# EAGLE design anet-cap-z-probe (EAGLE 6.1)
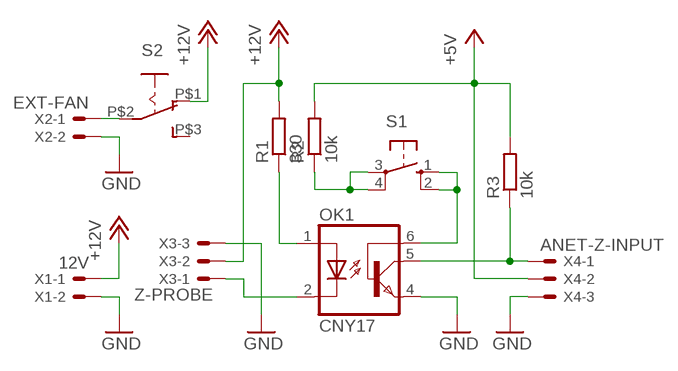
[diagram p0: schematic, sheet 1]

## Parts
OK1  CNY17  [DIL06]
R1  330  R-EU_R0805  [R0805]
R2  10k  R-EU_R0805  [R0805]
R3  10k  R-EU_R0805  [R0805]
S1  10-XX  [B3F-10XX]
S2  EG1218THIN  [THIN]
X1  12V  JST-XH-02-PIN-LONG-PAD  [JST-XH-02-PACKAGE-LONG-PAD]
X2  EXT-FAN  JST-XH-02-PIN-LONG-PAD  [JST-XH-02-PACKAGE-LONG-PAD]
X3  Z-PROBE  JST-XH-03-PIN-LONG-PAD  [JST-XH-03-PACKAGE-LONG-PAD]
X4  ANET-Z-INPUT  JST-XH-03-PIN-LONG-PAD  [JST-XH-03-PACKAGE-LONG-PAD]

## Nets
+5V: R2.2 R3.2 X4.2
+12V: R1.2 S2.P$1(O) X1.1 X3.2
GND: OK1.4(EMI) X1.2 X2.2 X3.3 X4.3
N$1: S2.P$2(P) X2.1
N$2: OK1.5(COL) R3.1 X4.1
N$4: R2.1 S1.3(P) S1.4(P1)
N$5: OK1.6(BAS) S1.1(S) S1.2(S1)
N$6: OK1.1(A) R1.1
N$7: OK1.2(C) X3.1
Unconnected: S2.P$3(S)

## Library data of the parts
OK1 = optocoupler:CNY17: SIEMENS OPTO COUPLER; MPN: CNY17-1; OC_FARNELL: 1045399; OC_NEWARK: 05M4044
R1-R3 = rcl:R-EU_: RESISTOR, European symbol
S1 = switch-omron:10-XX: OMRON SWITCH; MPN: B3F-1000; OC_FARNELL: 176432; OC_NEWARK: 36M3542
S2 = _MY_OWN_LIB:EG1218: SLIDING SWITCH 0.1" spacing through hole, vertical SPDT slide switch http://www.ladyada.net/library/pcb/eaglelibrary.html
X1 X2 = Rembrandt Electronics - JST XH Connectors v1-0:JST-XH-02-PIN: JST XH Connector 2 Pin Wire to board connector. Pitch: 2,54 mm, (0.100") Number of pins: 2 Created by Rembrandt Electronics www.rembrandtelectronics.com
X3 X4 = Rembrandt Electronics - JST XH Connectors v1-0:JST-XH-03-PIN: JST XH Connector 2 Pin Wire to board connector. Pitch: 2,54 mm, (0.100") Number of pins: 3 Created by Rembrandt Electronics www.rembrandtelectronics.com

## Board
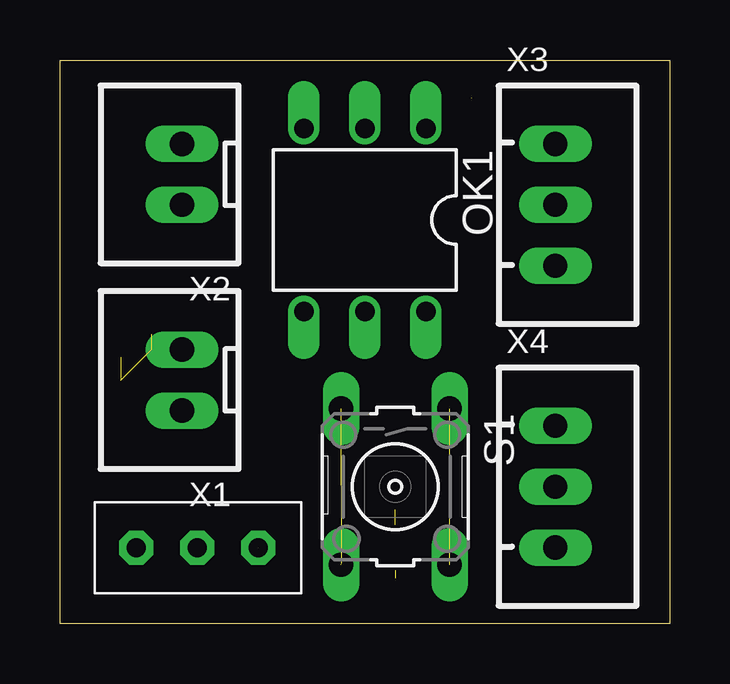
[diagram p1: board, top side]
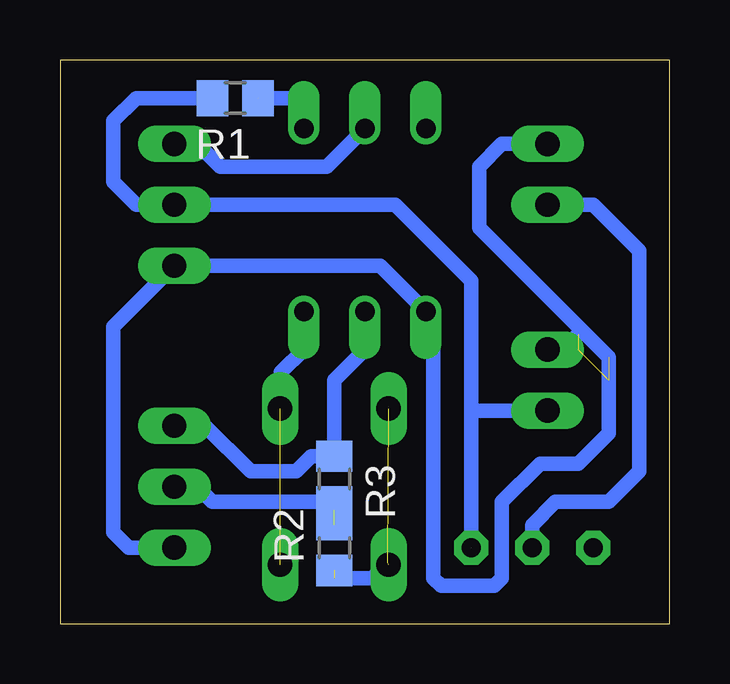
[diagram p2: board, bottom side, seen from below]

Size 25.4 x 23.5 mm. Coordinates in mm from the lower left corner, seen from the top.
Outline: 0,0 0,23.5 25.4,23.5 25.4,0 0,0
Copper layers (1*16): Top 0.035mm / dielectric 1.5mm / Bottom 0.035mm
Design rules: minimum track width 10mil, minimum drill 24mil, track to track 12mil, track to pad 12mil, pad to pad 12mil, via to via 12mil, smd to smd 10mil, copper to edge 12mil, drill to drill 12mil, minimum pad ring 10mil, minimum via ring 10mil, stop-mask expansion 4mil, vias tented up to drill 0mil, thermal gap 12mil

### Footprints (pad centres in the part's own frame; a part is rotated, then mirrored left to right if it is on the bottom)
DIL06 = drill 0.813 offset: 1 -2.54,-3.81; 2 0,-3.81; 3 2.54,-3.81; 4 2.54,3.81; 5 0,3.81; 6 -2.54,3.81
R0805 = smd 1.3 x 1.5: 1 -0.95,0; 2 0.95,0
B3F-10XX = drill 1.016 long: 1 -3.251,2.261; 2 3.251,2.261; 3 -3.251,-2.261; 4 3.251,-2.261
THIN = drill 0.8 pad 1.422 octagon: P$1 -2.548,-0.002; P$2 -0.008,-0.002; P$3 2.532,-0.002
JST-XH-02-PACKAGE-LONG-PAD = drill 1.016 long: 1 -1.27,0; 2 1.27,0
JST-XH-03-PACKAGE-LONG-PAD = drill 1.016 long: 1 -2.54,0; 2 0,0; 3 2.54,0

### Placement (x,y rotation side)
OK1  12.7,16.83 180 top
R1  18.1,21.91 180 bottom
R2  13.97,3.17 90 bottom
R3  13.97,6.03 270 bottom
S1  13.97,5.71 270 top
S2  5.71,3.17 180 top
X1  5.08,10.16 90 top
X2  5.08,18.73 90 top
X3  20.64,17.46 270 top
X4  20.64,5.71 270 top

### Tracks (layer width: path | path; a pad name or v marks a point on that pad's centre or on a via)
+5V  (1 unrouted)
  Bottom 0.61: R3.2 | 13.97,4.76 R3.2 | R3.2 19.05,5.08 19.68,5.71 X4.2
+12V  (1 unrouted)
  Bottom 0.61: R1.2 22.23,21.91 23.18,20.95 23.18,18.41 22.23,17.46 X3.2 11.43,17.46 8.26,14.29 8.26,8.89 | 8.26,8.89 S2.P$1 | X1.1 8.26,8.89
GND  (3 unrouted)
  Bottom 0.61: X4.3 22.54,3.17 23.18,3.81 23.18,12.38 X3.3 12.06,14.92 OK1.4 10.16,11.75 9.84,11.43 9.84,1.91 9.53,1.59 7.3,1.59 6.99,1.91 6.99,5.08 5.4,6.67 3.81,6.67 2.54,7.94 2.54,11.11 7.94,16.51 7.94,19.05 6.99,20 X2.2 | X1.2 4.45,11.43 3.81,12.06
N$1
  Bottom 0.61: S2.P$2 5.72,4.12 4.76,5.08 2.54,5.08 1.27,6.35 1.27,15.56 3.17,17.46 X2.1
N$2
  Bottom 0.61: OK1.5 12.7,11.43 13.97,10.16 R3.1 14.93,6.98 15.56,6.35 17.46,6.35 19.37,8.26 X4.1
N$4  (3 unrouted)
  Bottom 0.61: 13.97,1.91 12.38,1.91 11.75,2.54
N$5  (1 unrouted)
  Bottom 0.61: OK1.6 15.24,11.43 16.19,10.48 16.19,9 S1.1
N$6  (1 unrouted)
  Bottom 0.61: OK1.1 15.24,21.91 R1.1
N$7
  Bottom 0.61: X3.1 19.68,20 18.73,19.05 14.29,19.05 OK1.2